# EAGLE design labwiz-module_t420-v0.2 (EAGLE 6.5.0)

## Sheet 1 of 2
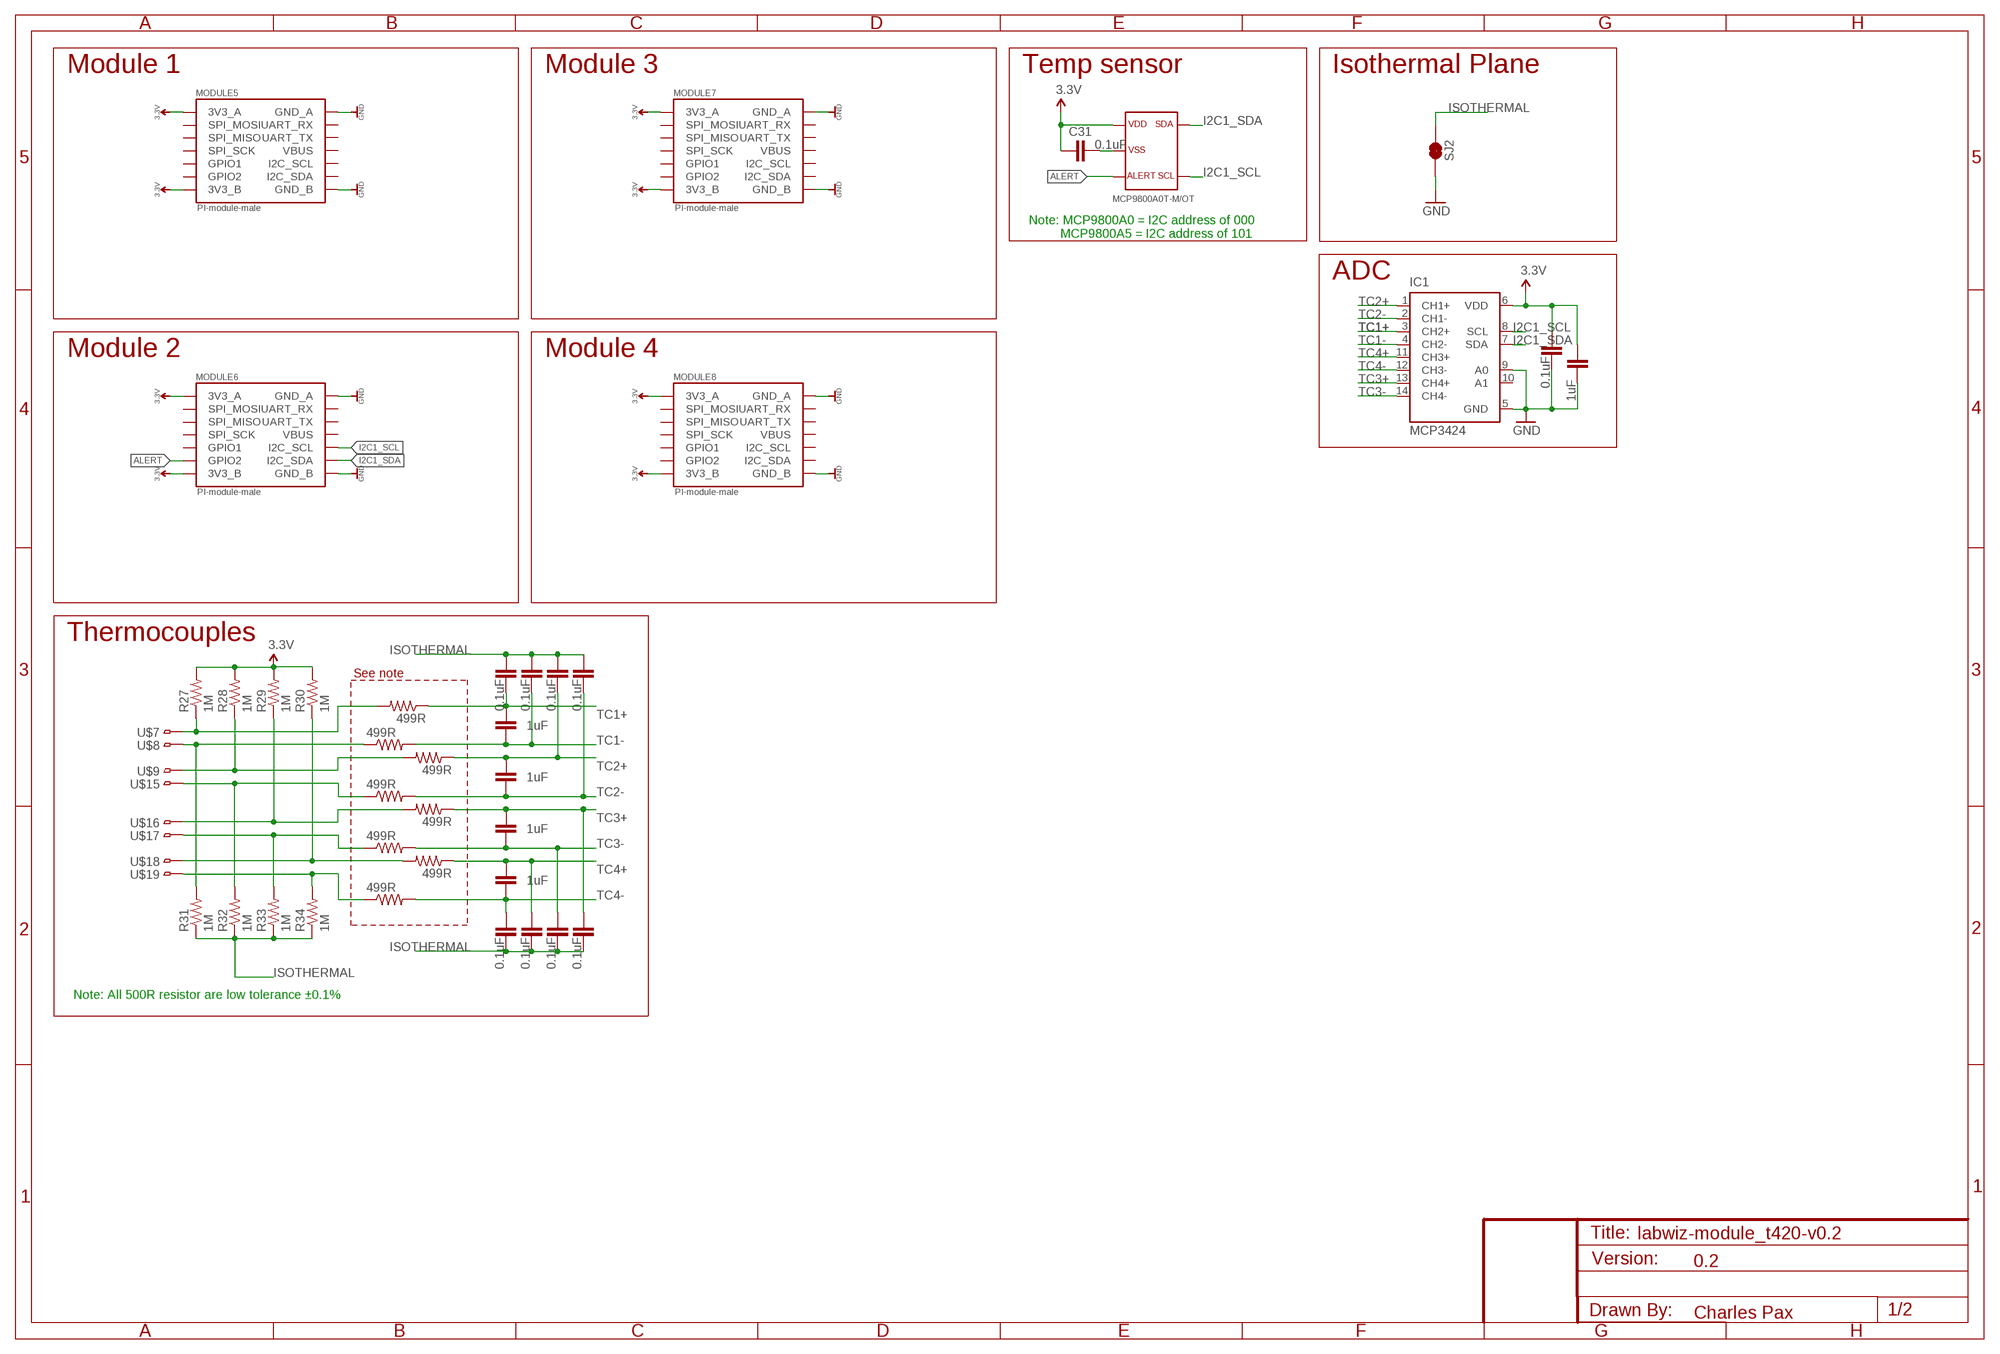
[diagram p0: schematic, sheet 1]

### Parts
C7  1uF  SPARKFUN-CAPACITORS_CAP0603-CAP  [SPARKFUN-CAPACITORS_0603-CAP]
C8  1uF  SPARKFUN-CAPACITORS_CAP0603-CAP  [SPARKFUN-CAPACITORS_0603-CAP]
C10  1uF  SPARKFUN-CAPACITORS_CAP0603-CAP  [SPARKFUN-CAPACITORS_0603-CAP]
C11  1uF  SPARKFUN-CAPACITORS_CAP0603-CAP  [SPARKFUN-CAPACITORS_0603-CAP]
C13  0.1uF  SPARKFUN-CAPACITORS_CAP0603-CAP  [SPARKFUN-CAPACITORS_0603-CAP]
C14  0.1uF  SPARKFUN-CAPACITORS_CAP0603-CAP  [SPARKFUN-CAPACITORS_0603-CAP]
C15  0.1uF  SPARKFUN-CAPACITORS_CAP0603-CAP  [SPARKFUN-CAPACITORS_0603-CAP]
C16  0.1uF  SPARKFUN-CAPACITORS_CAP0603-CAP  [SPARKFUN-CAPACITORS_0603-CAP]
C17  0.1uF  SPARKFUN-CAPACITORS_CAP0603-CAP  [SPARKFUN-CAPACITORS_0603-CAP]
C24  0.1uF  SPARKFUN-CAPACITORS_CAP0603-CAP  [SPARKFUN-CAPACITORS_0603-CAP]
C25  0.1uF  SPARKFUN-CAPACITORS_CAP0603-CAP  [SPARKFUN-CAPACITORS_0603-CAP]
C29  0.1uF  SPARKFUN-CAPACITORS_CAP0603-CAP  [SPARKFUN-CAPACITORS_0603-CAP]
C30  1uF  SPARKFUN-CAPACITORS_CAP0603-CAP  [SPARKFUN-CAPACITORS_0603-CAP]
C31  0.1uF  SPARKFUN-CAPACITORS_CAP0603-CAP  [SPARKFUN-CAPACITORS_0603-CAP]
C37  0.1uF  SPARKFUN-CAPACITORS_CAP0603-CAP  [SPARKFUN-CAPACITORS_0603-CAP]
IC1  MCP3424  [SO14]
MODULE5  PI-module-male  PAX_MODULE_EDGE_MALE_MODULE  [M07X2_2MM_EDGE]
MODULE6  PI-module-male  PAX_MODULE_EDGE_MALE_MODULE  [M07X2_2MM_EDGE]
MODULE7  PI-module-male  PAX_MODULE_EDGE_MALE_MODULE  [M07X2_2MM_EDGE]
MODULE8  PI-module-male  PAX_MODULE_EDGE_MALE_MODULE  [M07X2_2MM_EDGE]
R27  1M  SPARKFUN-RESISTORS_RESISTOR0603-RES  [SPARKFUN-RESISTORS_0603-RES]
R28  1M  SPARKFUN-RESISTORS_RESISTOR0603-RES  [SPARKFUN-RESISTORS_0603-RES]
R29  1M  SPARKFUN-RESISTORS_RESISTOR0603-RES  [SPARKFUN-RESISTORS_0603-RES]
R30  1M  SPARKFUN-RESISTORS_RESISTOR0603-RES  [SPARKFUN-RESISTORS_0603-RES]
R31  1M  SPARKFUN-RESISTORS_RESISTOR0603-RES  [SPARKFUN-RESISTORS_0603-RES]
R32  1M  SPARKFUN-RESISTORS_RESISTOR0603-RES  [SPARKFUN-RESISTORS_0603-RES]
R33  1M  SPARKFUN-RESISTORS_RESISTOR0603-RES  [SPARKFUN-RESISTORS_0603-RES]
R34  1M  SPARKFUN-RESISTORS_RESISTOR0603-RES  [SPARKFUN-RESISTORS_0603-RES]
R35  499R  SPARKFUN-RESISTORS_RESISTOR0603-RES  [SPARKFUN-RESISTORS_0603-RES]
R36  499R  SPARKFUN-RESISTORS_RESISTOR0603-RES  [SPARKFUN-RESISTORS_0603-RES]
R37  499R  SPARKFUN-RESISTORS_RESISTOR0603-RES  [SPARKFUN-RESISTORS_0603-RES]
R38  499R  SPARKFUN-RESISTORS_RESISTOR0603-RES  [SPARKFUN-RESISTORS_0603-RES]
R39  499R  SPARKFUN-RESISTORS_RESISTOR0603-RES  [SPARKFUN-RESISTORS_0603-RES]
R40  499R  SPARKFUN-RESISTORS_RESISTOR0603-RES  [SPARKFUN-RESISTORS_0603-RES]
R41  499R  SPARKFUN-RESISTORS_RESISTOR0603-RES  [SPARKFUN-RESISTORS_0603-RES]
R42  499R  SPARKFUN-RESISTORS_RESISTOR0603-RES  [SPARKFUN-RESISTORS_0603-RES]
SJ2  JUMPER-PAD-2-NC_BY_TRACE  [PAD-JUMPER-2-NC_BY_TRACE_YES_SILK]
U1  MCP9800  [SOT23-5L]
U$7  TC-MINI-SINGLE  [TC-CLIP-SINGLE]
U$8  TC-MINI-SINGLE  [TC-CLIP-SINGLE]
U$9  TC-MINI-SINGLE  [TC-CLIP-SINGLE]
U$15  TC-MINI-SINGLE  [TC-CLIP-SINGLE]
U$16  TC-MINI-SINGLE  [TC-CLIP-SINGLE]
U$17  TC-MINI-SINGLE  [TC-CLIP-SINGLE]
U$18  TC-MINI-SINGLE  [TC-CLIP-SINGLE]
U$19  TC-MINI-SINGLE  [TC-CLIP-SINGLE]

### Nets
3.3V: C29.1 C30.1 C31.1 IC1.6(VDD) MODULE5.P$1(3V3_B) MODULE5.P$13(3V3_A) MODULE6.P$1(3V3_B) MODULE6.P$13(3V3_A) MODULE7.P$1(3V3_B) MODULE7.P$13(3V3_A) MODULE8.P$1(3V3_B) MODULE8.P$13(3V3_A) R27.2 R28.2 R29.2 R30.2 U1.1
ALERT: MODULE6.P$3(GPIO2) U1.3
GND: C29.2 C30.2 IC1.5(GND) IC1.9(A0) MODULE5.P$2(GND_B) MODULE5.P$14(GND_A) MODULE6.P$2(GND_B) MODULE6.P$14(GND_A) MODULE7.P$2(GND_B) MODULE7.P$14(GND_A) MODULE8.P$2(GND_B) MODULE8.P$14(GND_A) SJ2.1
I2C1_SCL: IC1.8(SCL) MODULE6.P$6(I2C_SCL) U1.4
I2C1_SDA: IC1.7(SDA) MODULE6.P$4(I2C_SDA) U1.5
ISOTHERMAL: C13.2 C14.2 C15.2 C16.2 C17.1 C24.1 C25.1 C31.2 C37.1 R31.1 R32.1 R33.1 R34.1 SJ2.2 U1.2
N$1: R27.1 R35.2 U$7.P$1
N$4: R32.2 R38.1 U$15.P$1
N$5: R31.2 R36.1 U$8.P$1
N$10: R28.1 R37.2 U$9.P$1
N$12: R30.1 R40.2 U$18.P$1
N$13: R29.1 R39.2 U$16.P$1
N$14: R33.2 R41.1 U$17.P$1
N$16: R34.2 R42.1 U$19.P$1
TC1+: C7.1 C17.2 IC1.3(CH2+) R35.1
TC1-: C7.2 C24.2 IC1.4(CH2-) R36.2
TC2+: C8.1 C25.2 IC1.1(CH1+) R37.1
TC2-: C8.2 C37.2 IC1.2(CH1-) R38.2
TC3+: C10.1 C16.1 IC1.13(CH4+) R39.1
TC3-: C10.2 C15.1 IC1.14(CH4-) R41.2
TC4+: C11.1 C14.1 IC1.11(CH3+) R40.1
TC4-: C11.2 C13.1 IC1.12(CH3-) R42.2
Unconnected: IC1.10(A1) MODULE5.P$3(GPIO2) MODULE5.P$4(I2C_SDA) MODULE5.P$5(GPIO1) MODULE5.P$6(I2C_SCL) MODULE5.P$7(SPI_SCK) MODULE5.P$8(VBUS) MODULE5.P$9(SPI_MISO) MODULE5.P$10(UART_TX) MODULE5.P$11(SPI_MOSI) MODULE5.P$12(UART_RX) MODULE6.P$5(GPIO1) MODULE6.P$7(SPI_SCK) MODULE6.P$8(VBUS) MODULE6.P$9(SPI_MISO) MODULE6.P$10(UART_TX) MODULE6.P$11(SPI_MOSI) MODULE6.P$12(UART_RX) MODULE7.P$3(GPIO2) MODULE7.P$4(I2C_SDA) MODULE7.P$5(GPIO1) MODULE7.P$6(I2C_SCL) MODULE7.P$7(SPI_SCK) MODULE7.P$8(VBUS) MODULE7.P$9(SPI_MISO) MODULE7.P$10(UART_TX) MODULE7.P$11(SPI_MOSI) MODULE7.P$12(UART_RX) MODULE8.P$3(GPIO2) MODULE8.P$4(I2C_SDA) MODULE8.P$5(GPIO1) MODULE8.P$6(I2C_SCL) MODULE8.P$7(SPI_SCK) MODULE8.P$8(VBUS) MODULE8.P$9(SPI_MISO) MODULE8.P$10(UART_TX) MODULE8.P$11(SPI_MOSI) MODULE8.P$12(UART_RX)

### Notes on the sheet
- Module 1 | Module 3 | Temp sensor | Isothermal Plane
- Note: MCP9800A0 = I2C address of 000
           MCP9800A5 = I2C address of 101
- ADC
- Module 2 | Module 4
- Thermocouples
- See note
- Note: All 500R resistor are low tolerance ±0.1%
- 0.2
- Charles Pax

## Sheet 2 of 2

## Library data of the parts
C7 C8 C10 C11 C13-C17 C24 C25 C29-C31 C37 = PaxInstrument-T400:SPARKFUN-CAPACITORS_CAP: Capacitor Standard 0603 ceramic capacitor, and 0.1" leaded capacitor.
IC1 = JeeLabs:MCP3424: 18-Bit, 4-Channel Sampling ANALOG-TO-DIGITAL CONVERTER with I2C? Interface Source: www.ti.com .. ADS7828.pdf; MF: Microchip Technology; MPN: MCP3424-E/SL
MODULE5-MODULE8 = PaxInstruments-Connectors:PAX_MODULE; MF: Pax Instruments; MPN: PIxxxx
R27-R34 = PaxInstrument-T400:SPARKFUN-RESISTORS_RESISTOR: Resistor Basic schematic elements and footprints for 0603, 1206, and PTH resistors.
R35-R42 = PaxInstrument-T400:SPARKFUN-RESISTORS_RESISTOR: Resistor Basic schematic elements and footprints for 0603, 1206, and PTH resistors.; MF: Vishay; MPN: TNPW0603499RBEEA
SJ2 = SparkFun-Passives:JUMPER-PAD-2-NC_BY_TRACE; MF: N/A; MPN: N/A
U1 = newparts_2010:MCP9800: Temperature sensor I2C output, Microchip. Farnell 1439485; MF: Microchip Technology; MPN: MCP9800A0T-M/OT
U$7-U$9 U$15-U$19 = PaxInstruments-Connectors:TC-MINI-SINGLE; MF: Pax Instrument; MPN: Thermo-clip2

## Net classes
0 Digital signal: width 0.1 mm, drill 0.2 mm, clearance 0.15 mm
1 3.3V power: width 0.1 mm, drill 0.2 mm, clearance 0.15 mm
2 RTC battery: width 0.1 mm, drill 0.2 mm, clearance 0.15 mm
3 5V power: width 0.1 mm, drill 0.2 mm, clearance 0.15 mm
4 Analog signal: width 0.1 mm, drill 0.2 mm, clearance 0.15 mm
5 GND: width 0.1 mm, drill 0.2 mm, clearance 0.15 mm

## Board
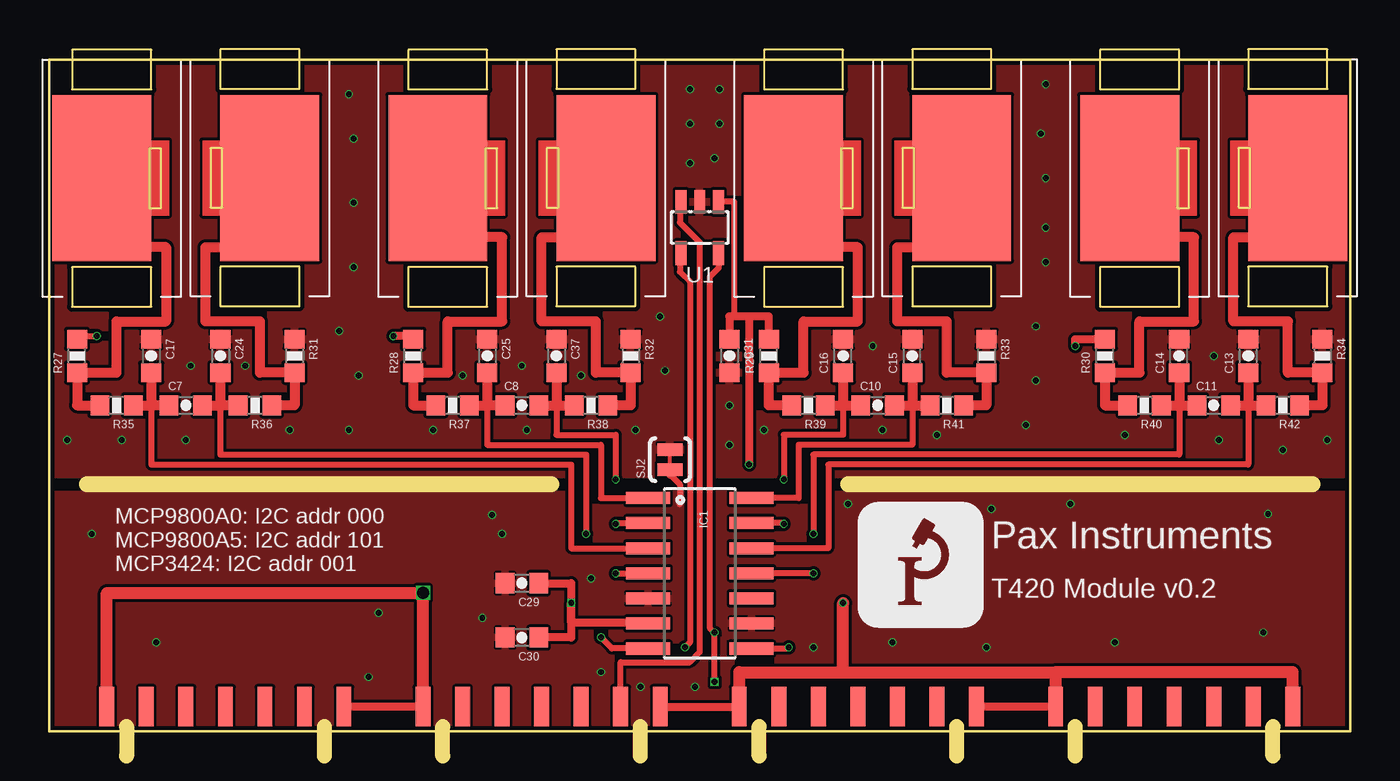
[diagram p1: board, top side]
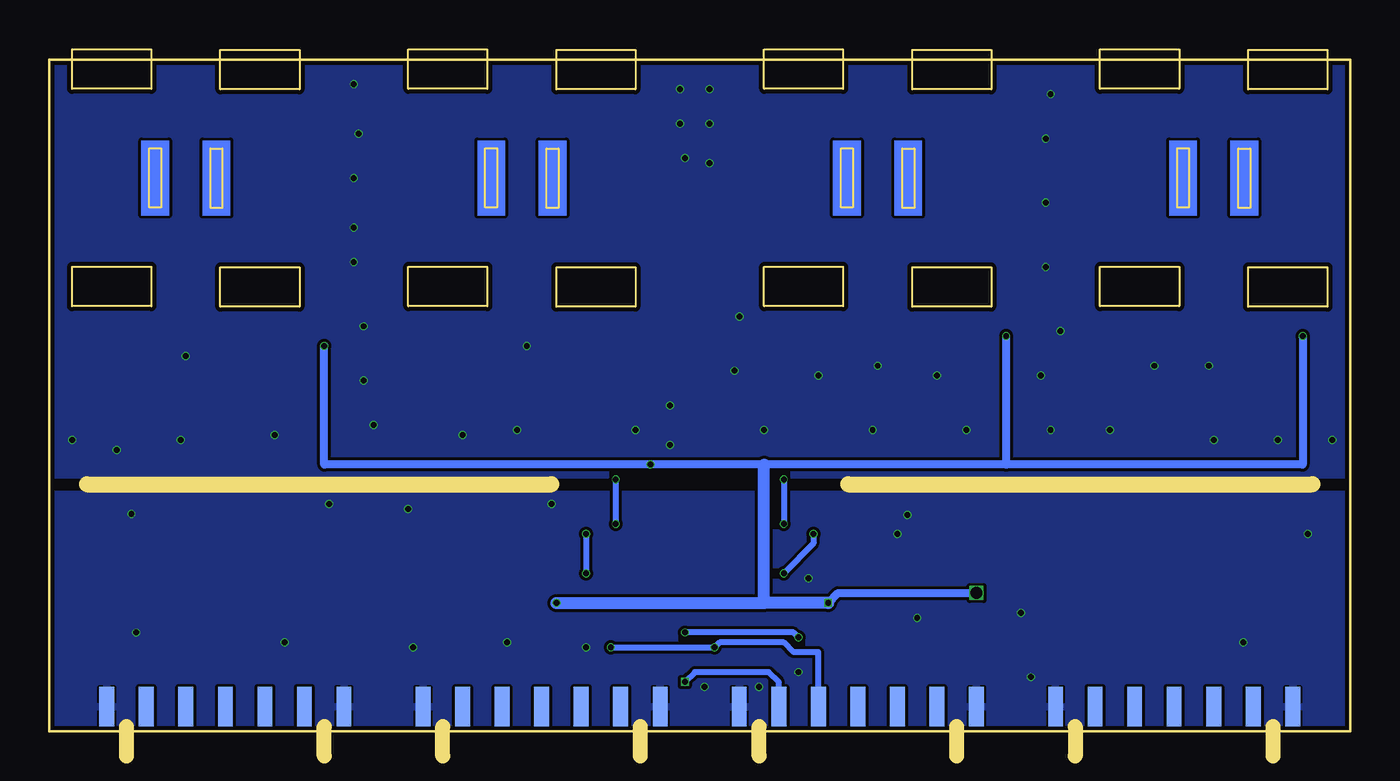
[diagram p2: board, bottom side, seen from below]

Size 65.8 x 34 mm. Coordinates in mm from the lower left corner, seen from the top.
Outline: 0,34 0,0 65.8,0 65.8,34 0,34
Copper layers (1*2+15*16): Top 0.017mm / dielectric 0.5mm / GND 0.017mm / dielectric 0.075mm / 3.3V 0.017mm / dielectric 0.5mm / Bottom 0.017mm
Design rules "PaxInstrument-T400 *": minimum track width 0.1mm, minimum drill 0.2mm, track to track 0.075mm, track to pad 0.075mm, pad to pad 0.075mm, via to via 0.075mm, smd to smd 0.075mm, copper to edge 0.2mm, drill to drill 0.2mm, minimum pad ring 0.5mm, minimum via ring 0.05mm, stop-mask expansion 0.01mm, vias tented up to drill 0.25mm, thermal gap 0.1mm
Milling: 10 lines

### Footprints (pad centres in the part's own frame; a part is rotated, then mirrored left to right if it is on the bottom)
SPARKFUN-CAPACITORS_0603-CAP = smd 0.94 x 1.016: 1 -0.85,0; 2 0.85,0
SO14 = smd 0.61 x 2.21: 1 -3.81,-2.616; 2 -2.54,-2.616; 3 -1.27,-2.616; 4 0,-2.616; 5 1.27,-2.616; 6 2.54,-2.616; 7 3.81,-2.616; 8 3.81,2.616; 9 2.54,2.616; 10 1.27,2.616; 11 0,2.616; 12 -1.27,2.616; 13 -2.54,2.616; 14 -3.81,2.616
M07X2_2MM_EDGE = smd 0.75 x 2: P$1 0,-0.25; P$3 2,-0.25; P$5 4,-0.25; P$7 6,-0.25; P$9 8,-0.25; P$11 10,-0.25; P$13 12,-0.25 | smd 0.75 x 2 bottom: P$2 0,-0.25; P$4 2,-0.25; P$6 4,-0.25; P$8 6,-0.25; P$10 8,-0.25; P$12 10,-0.25; P$14 12,-0.25
SPARKFUN-RESISTORS_0603-RES = smd 0.94 x 1.016: 1 -0.85,0; 2 0.85,0
PAD-JUMPER-2-NC_BY_TRACE_YES_SILK = smd 0.635 x 1.27: 1 -0.508,0; 2 0.508,0
SOT23-5L = smd 0.55 x 1.2: 1 -0.95,-1.3; 2 0,-1.3; 3 0.95,-1.3; 4 0.95,1.3; 5 -0.95,1.3
TC-CLIP-SINGLE = smd 5 x 8.4: P$1 -0.5,0

### Placement (x,y rotation side)
C7  6.9,16.5 0 top
C8  23.9,16.5 0 top
C10  41.9,16.5 0 top
C11  58.9,16.5 0 top
C13  60.65,19 90 top
C14  57.15,19 90 top
C15  43.65,19 90 top
C16  40.15,19 90 top
C17  5.15,19 270 top
C24  8.65,19 270 top
C25  22.15,19 270 top
C29  23.9,7.5 180 top
C30  23.9,4.75 180 top
C31  34.4,19 270 top
C37  25.65,19 270 top
IC1  32.9,8 270 top
MODULE5  14.9,1 180 top
MODULE6  30.9,1 180 top
MODULE7  46.9,1 180 top
MODULE8  62.9,1 180 top
R27  1.4,19 90 top
R28  18.4,19 90 top
R29  36.4,19 90 top
R30  53.4,19 90 top
R31  12.4,19 270 top
R32  29.4,19 270 top
R33  47.4,19 270 top
R34  64.4,19 270 top
R35  3.4,16.5 180 top
R36  10.4,16.5 180 top
R37  20.4,16.5 180 top
R38  27.4,16.5 180 top
R39  38.4,16.5 180 top
R40  55.4,16.5 180 top
R41  45.4,16.5 180 top
R42  62.4,16.5 180 top
SJ2  31.4,13.75 90 top
U1  32.9,25.5 180 top
U$1  [PAX-LOGO-0.25IN]  40.9,5.25 0 top
U$7  3.15,28 0 top
U$8  10.65,28 180 top
U$9  20.15,28 0 top
U$15  27.65,28 180 top
U$16  38.15,28 0 top
U$17  45.65,28 180 top
U$18  55.15,28 0 top
U$19  62.65,28 180 top

### Tracks (layer width: path | path; a pad name or v marks a point on that pad's centre or on a via)
3.3V  (via drill 0.3, 0.6)
  Top 0.305: 34.4,21 34.65,21 34.65,26.8 U1.1 | R27.2 1.4,20 v2.4,20
  Top 0.406: v51.9,19.5 51.9,19.85 R30.2 | R28.2 18.4,20 v17.4,20 | R29.2 36.4,21 35.4,21 | 35.4,21 v35.4,13.5 | 35.4,21 34.4,21 C31.1 | v26.4,6.5 26.4,4.75 C30.1 | IC1.6 30.4,5.5 26.4,5.5 v26.4,6.5 | C29.1 26.4,7.5 v26.4,6.5 | MODULE6.P$13 MODULE5.P$1 | MODULE6.P$1 MODULE7.P$13 | MODULE8.P$13 MODULE7.P$1
  Top 0.61: MODULE6.P$13 v18.9,7 2.9,7 MODULE5.P$13 | MODULE7.P$13 34.9,3 40.15,3 | 40.15,3 50.9,3 | 50.9,3 MODULE8.P$13 | 40.15,3 v40.15,6.5 | MODULE8.P$1 62.9,3 50.9,3
  Bottom 0.406: v2.4,20 2.4,13.5 17.4,13.5 | 17.4,13.5 29.65,13.5 v35.4,13.5 51.9,13.5 v51.9,19.5 | v17.4,20 17.4,13.5 | v26.4,6.5 25.9,7 v18.9,7
  Bottom 0.61: v26.4,6.5 29.65,6.5 | 29.65,6.5 29.65,13.5 | v40.15,6.5 29.65,6.5
ALERT
  Top 0.305: U1.3 31.9,26.75 31.9,25.75 32.9,24.75 32.9,4 32.4,3.5 28.9,3.5 MODULE6.P$3
GND  (via drill 0.3)
  Top 0.305: 31.4,13 31.9,12.5 31.9,11.5
  Top 0.406: SJ2.1 31.4,13
  other vias: 22.9,10 16.65,6 2.15,10 29.9,2.25 5.4,4.5 22.4,10.95 32.65,2.25 40.4,11.5 42.65,4.5 47.65,11.25 47.4,4.25 51.65,11.5 53.9,4.5 61.65,11 61.4,5 16.15,2.75 21.9,5.75 27.4,7.75 27.9,3 38.65,4.25
  pour Bottom: -0.1,12 -0.1,0 65.9,0 65.9,12
  pour Top: -0.1,12 -0.1,0 65.9,0 65.9,12
I2C1_SCL  (via drill 0.3)
  Top 0.305: U1.4 31.9,24.2 31.9,23.25 32.4,22.75 32.4,4.5 v32.15,4.25 | IC1.8 37.34,4.19 v37.4,4.25
  Bottom 0.305: v37.4,4.25 v32.15,4.25 31.9,4.5 28.65,4.5 28.15,4 26.9,4 MODULE6.P$6
I2C1_SDA  (via drill 0.3)
  Top 0.305: U1.5 33.85,23.45 33.4,23 33.4,5.25 v33.65,5 v33.65,2.5 | IC1.7 28.46,4.19 v27.9,4.75
  Bottom 0.305: v27.9,4.75 28.15,5 v33.65,5 | MODULE6.P$4 28.9,2.5 29.4,3 33.15,3 v33.65,2.5
ISOTHERMAL  (via drill 0.3)
  other vias: 15.65,18 20.9,18 23.9,18.5 26.9,18 7.15,18.5 9.9,18.5 6.9,14.75 3.65,14.75 0.9,14.75 12.15,15.25 15.15,15.25 14.65,20.25 15.4,23.5 15.4,26.75 15.4,30 15.15,32.25 32.4,32.5 33.9,32.5 32.4,30.75 33.9,30.75 32.4,28.75 33.65,29 50.4,32.75 50.15,30.25 50.4,28 50.4,25.5 50.4,23.75 49.9,20.5 44.9,15 49.4,15.5 49.9,17.75 54.4,15 59.15,14.75 58.9,19 62.4,14.25 64.65,14.75 41.65,19.5 42.15,15.25 36.15,15.25 34.4,16.5 34.4,14.5 30.9,21 31.15,18.25 29.65,15.25 19.4,15.25 24.15,15.25
  pour Bottom: -0.1,34 65.9,34 65.9,13 -0.1,13
  pour Top: -0.1,34 65.9,34 65.9,13 -0.1,13
N$1
  Top 0.5: R35.2 1.4,16.5 R27.1 3.4,18.15 3.4,20.75 5.9,20.75 5.9,24.5 2.65,24.5 U$7.P$1
N$4
  Top 0.5: R38.1 29.4,16.5 R32.2 27.65,18.15 27.65,20.75 24.9,20.75 24.9,25 28.15,25 U$15.P$1
N$5
  Top 0.5: R36.1 12.4,16.5 R31.2 10.65,18.15 10.65,20.75 7.9,20.75 7.9,24.5 11.15,24.5 U$8.P$1
N$10
  Top 0.5: R37.2 18.4,16.5 R28.1 20.15,18.15 20.15,20.75 22.9,20.75 22.9,25 19.65,25 U$9.P$1
N$12
  Top 0.5: R40.2 53.4,16.5 R30.1 55.15,18.15 55.15,20.75 57.9,20.75 57.9,25 54.65,25 U$18.P$1
N$13
  Top 0.5: R39.2 36.4,16.5 R29.1 38.15,18.15 38.15,20.75 40.9,20.75 40.9,24.5 37.65,24.5 U$16.P$1
N$14
  Top 0.5: R41.1 47.4,16.5 R33.2 45.4,18.15 45.4,20.75 42.9,20.75 42.9,24.5 46.15,24.5 U$17.P$1
N$16
  Top 0.5: R42.1 64.4,16.5 R34.2 62.65,18.15 62.65,20.75 59.9,20.75 59.9,25 63.15,25 U$19.P$1
TC1+
  Top 0.305: 5.15,16.5 5.15,13.5 26.4,13.5 26.4,9.27 IC1.3
  Top 0.5: R35.1 5.15,16.5 | C17.2 5.15,16.5 | C7.1 5.15,16.5
TC1-  (via drill 0.3)
  Top 0.305: 8.65,16.5 8.65,14 27.15,14 v27.15,10 | v28.65,8 IC1.4
  Top 0.5: C7.2 8.65,16.5 | C24.2 8.65,16.5 | R36.2 8.65,16.5
  Bottom 0.305: v27.15,10 27.15,9.5 v28.65,8
TC2+
  Top 0.305: 22.15,16.5 22.15,14.5 27.9,14.5 27.9,11.81 IC1.1
  Top 0.5: R37.1 22.15,16.5 | C25.2 22.15,16.5 | C8.1 22.15,16.5
TC2-  (via drill 0.3)
  Top 0.305: 25.65,16.5 25.65,15 28.65,15 v28.65,12.75 | v28.65,10.5 28.65,10.54 IC1.2
  Top 0.5: C8.2 25.65,16.5 | 25.65,16.5 R38.2 | C37.2 25.65,16.5
  Bottom 0.305: v28.65,12.75 v28.65,10.5
TC3+  (via drill 0.3)
  Top 0.305: 40.15,16.5 40.15,15 37.15,15 v37.15,12.75 | v37.15,10.5 37.15,10.54 IC1.13
  Top 0.5: R39.1 40.15,16.5 | 40.15,16.5 C10.1 | C16.1 40.15,16.5
  Bottom 0.305: v37.15,12.75 v37.15,10.5
TC3-
  Top 0.305: 43.65,16.5 43.65,14.5 37.9,14.5 37.9,11.81 IC1.14
  Top 0.5: C10.2 43.65,16.5 | 43.65,16.5 R41.2 | C15.1 43.65,16.5
TC4+  (via drill 0.3)
  Top 0.305: 57.15,16.5 57.15,14 38.65,14 v38.65,10 | v38.65,8 IC1.11
  Top 0.5: R40.1 57.15,16.5 | 57.15,16.5 C11.1 | C14.1 57.15,16.5
  Bottom 0.305: v38.65,10 v38.65,8
TC4-
  Top 0.305: 60.65,16.5 60.65,13.5 39.4,13.5 39.4,9.27 IC1.12
  Top 0.5: C11.2 60.65,16.5 | 60.65,16.5 R42.2 | C13.1 60.65,16.5

### Text on the board
tPlace: MCP9800A0: I2C addr 000 / MCP9800A5: I2C addr 101 / MCP3424: I2C addr 001 | Pax Instruments | T420 Module v0.2